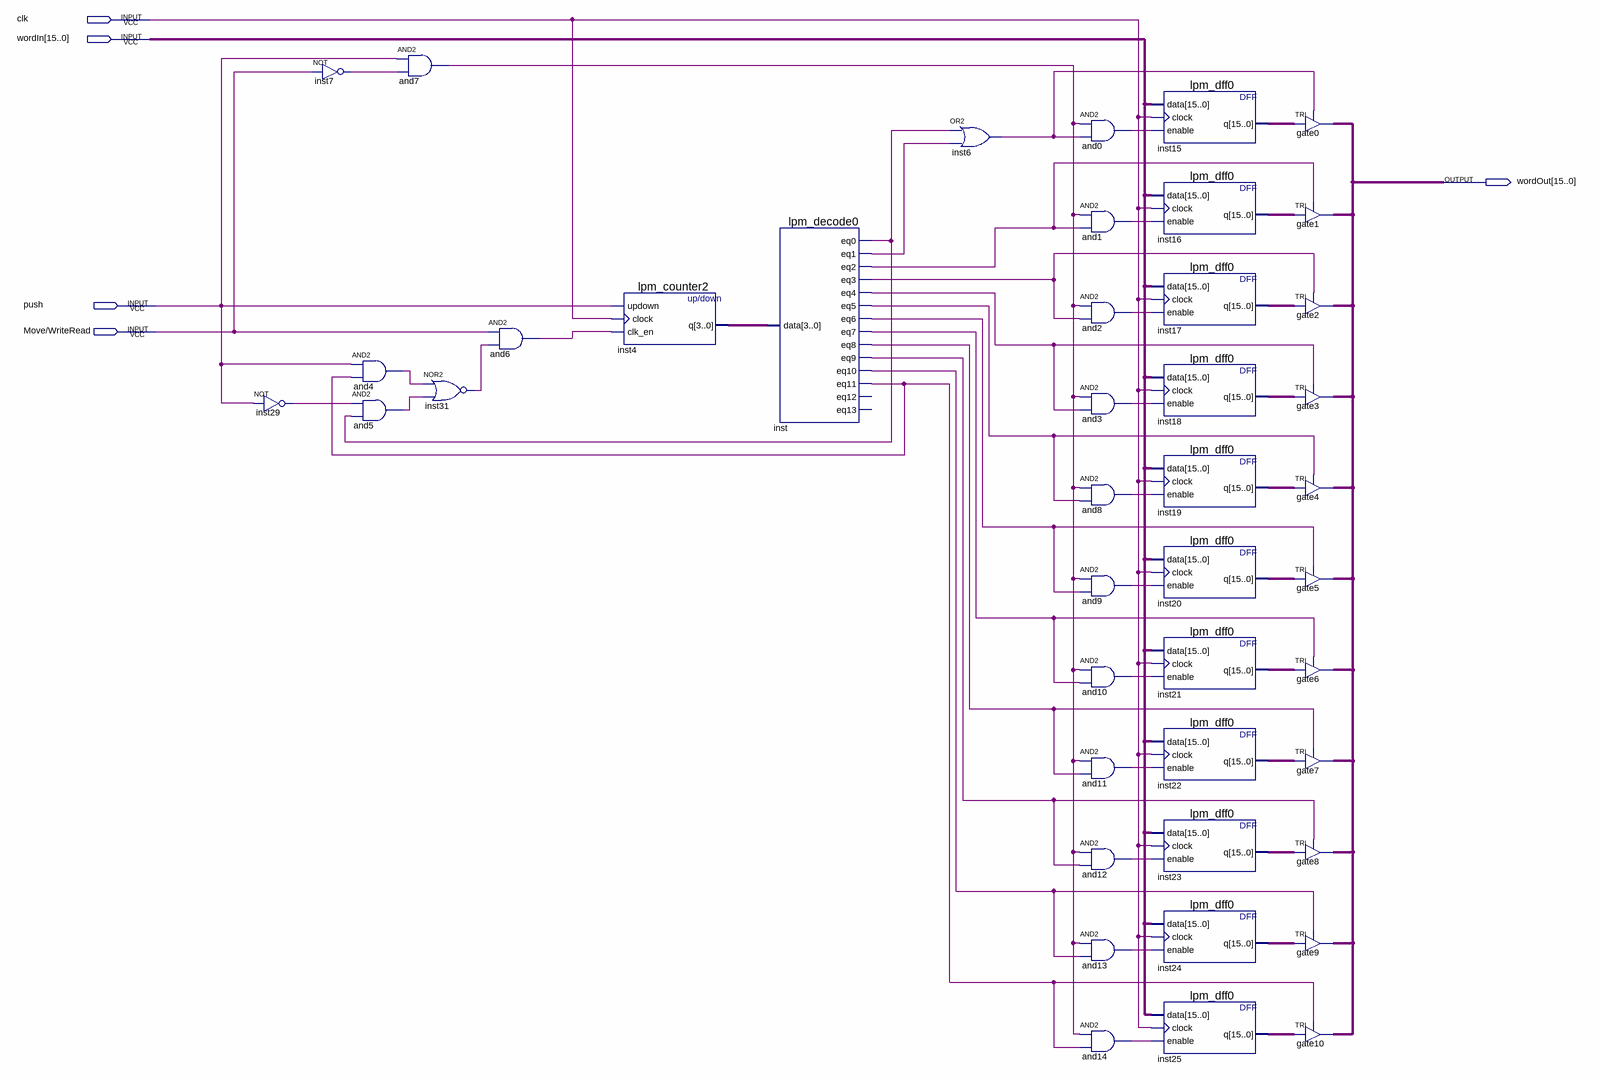
[diagram p0: schematic sheet]
// Quartus schematic stack.bdf as structural Verilog: 43 symbols, 5 pins
module stack (
  input  clk,
  input  [15:0] wordIn,
  input  push,
  input  \Move/WriteRead ,
  output [15:0] wordOut
);

  wire and0_out, and1_out, and2_out, and3_out, and4_out, and5_out, and6_out, and7_out, and8_out, and9_out,
       and10_out, and11_out, and12_out, and13_out, and14_out, inst6_out, inst7_out, inst29_out, inst31_out,
       inst_eq0, inst_eq1, inst_eq2, inst_eq3, inst_eq4, inst_eq5, inst_eq6, inst_eq7, inst_eq8, inst_eq9,
       inst_eq10, inst_eq11;
  wire [3:0] inst4_q;
  wire [15:0] inst15_q, inst16_q, inst17_q, inst18_q, inst19_q, inst20_q, inst21_q, inst22_q, inst23_q,
       inst24_q, inst25_q;

  not inst29 (inst29_out, push);
  not inst7 (inst7_out, \Move/WriteRead );
  and and4 (and4_out, push, inst_eq11);
  and and5 (and5_out, inst29_out, inst_eq0);
  and and7 (and7_out, push, inst7_out);
  nor inst31 (inst31_out, and4_out, and5_out);
  and and6 (and6_out, \Move/WriteRead , inst31_out);
  lpm_counter2 inst4 (.updown(push), .clock(clk), .clk_en(and6_out), .q(inst4_q));
  lpm_decode0 inst (
    .data(inst4_q), .eq0(inst_eq0), .eq1(inst_eq1), .eq2(inst_eq2), .eq3(inst_eq3), .eq4(inst_eq4),
    .eq5(inst_eq5), .eq6(inst_eq6), .eq7(inst_eq7), .eq8(inst_eq8), .eq9(inst_eq9), .eq10(inst_eq10),
    .eq11(inst_eq11));  // open: eq12, eq13
  or inst6 (inst6_out, inst_eq0, inst_eq1);
  and and0 (and0_out, and7_out, inst6_out);
  and and1 (and1_out, and7_out, inst_eq2);
  and and2 (and2_out, and7_out, inst_eq3);
  and and3 (and3_out, and7_out, inst_eq4);
  and and8 (and8_out, and7_out, inst_eq5);
  and and9 (and9_out, and7_out, inst_eq6);
  and and10 (and10_out, and7_out, inst_eq7);
  and and11 (and11_out, and7_out, inst_eq8);
  and and12 (and12_out, and7_out, inst_eq9);
  and and13 (and13_out, and7_out, inst_eq10);
  and and14 (and14_out, and7_out, inst_eq11);
  lpm_dff0 inst15 (.data(wordIn), .clock(clk), .enable(and0_out), .q(inst15_q));
  lpm_dff0 inst16 (.data(wordIn), .clock(clk), .enable(and1_out), .q(inst16_q));
  lpm_dff0 inst17 (.data(wordIn), .clock(clk), .enable(and2_out), .q(inst17_q));
  lpm_dff0 inst18 (.data(wordIn), .clock(clk), .enable(and3_out), .q(inst18_q));
  lpm_dff0 inst19 (.data(wordIn), .clock(clk), .enable(and8_out), .q(inst19_q));
  lpm_dff0 inst20 (.data(wordIn), .clock(clk), .enable(and9_out), .q(inst20_q));
  lpm_dff0 inst21 (.data(wordIn), .clock(clk), .enable(and10_out), .q(inst21_q));
  lpm_dff0 inst22 (.data(wordIn), .clock(clk), .enable(and11_out), .q(inst22_q));
  lpm_dff0 inst23 (.data(wordIn), .clock(clk), .enable(and12_out), .q(inst23_q));
  lpm_dff0 inst24 (.data(wordIn), .clock(clk), .enable(and13_out), .q(inst24_q));
  lpm_dff0 inst25 (.data(wordIn), .clock(clk), .enable(and14_out), .q(inst25_q));
  TRI gate0[15:0] (.IN(inst15_q), .OE(inst6_out), .OUT(wordOut));
  TRI gate1[15:0] (.IN(inst16_q), .OE(inst_eq2), .OUT(wordOut));
  TRI gate2[15:0] (.IN(inst17_q), .OE(inst_eq3), .OUT(wordOut));
  TRI gate3[15:0] (.IN(inst18_q), .OE(inst_eq4), .OUT(wordOut));
  TRI gate4[15:0] (.IN(inst19_q), .OE(inst_eq5), .OUT(wordOut));
  TRI gate5[15:0] (.IN(inst20_q), .OE(inst_eq6), .OUT(wordOut));
  TRI gate6[15:0] (.IN(inst21_q), .OE(inst_eq7), .OUT(wordOut));
  TRI gate7[15:0] (.IN(inst22_q), .OE(inst_eq8), .OUT(wordOut));
  TRI gate8[15:0] (.IN(inst23_q), .OE(inst_eq9), .OUT(wordOut));
  TRI gate9[15:0] (.IN(inst24_q), .OE(inst_eq10), .OUT(wordOut));
  TRI gate10[15:0] (.IN(inst25_q), .OE(inst_eq11), .OUT(wordOut));
endmodule
